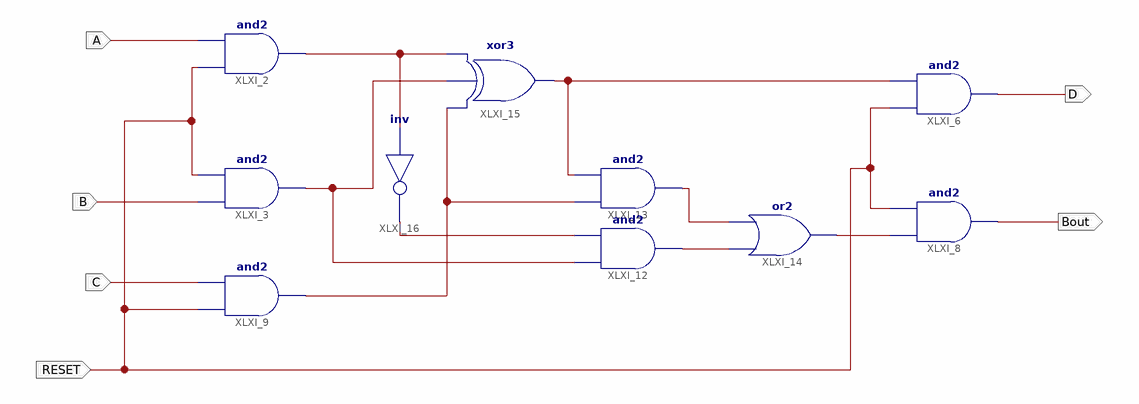
[diagram p0: schematic sheet 1]
// Xilinx ISE schematic FullSubEnable.sch (artix7) as structural Verilog: 10 symbols, 6 ports
module FullSubEnable (
  input  A,
  input  B,
  input  RESET,
  input  C,
  output D,
  output Bout
);

  wire XLXN_4, XLXN_7, XLXN_17, XLXN_24, XLXN_25, XLXN_26, XLXN_32, XLXN_33;

  and XLXI_2 (XLXN_7, RESET, A);
  and XLXI_3 (XLXN_4, B, RESET);
  and XLXI_9 (XLXN_17, RESET, C);
  and XLXI_12 (XLXN_26, XLXN_4, XLXN_33);
  and XLXI_13 (XLXN_25, XLXN_17, XLXN_24);
  or XLXI_14 (XLXN_32, XLXN_26, XLXN_25);
  xor XLXI_15 (XLXN_24, XLXN_17, XLXN_4, XLXN_7);
  not XLXI_16 (XLXN_33, XLXN_7);
  and XLXI_6 (D, RESET, XLXN_24);
  and XLXI_8 (Bout, XLXN_32, RESET);
endmodule
